# Altium schematic sheet Sheet1.SchDoc
size A4
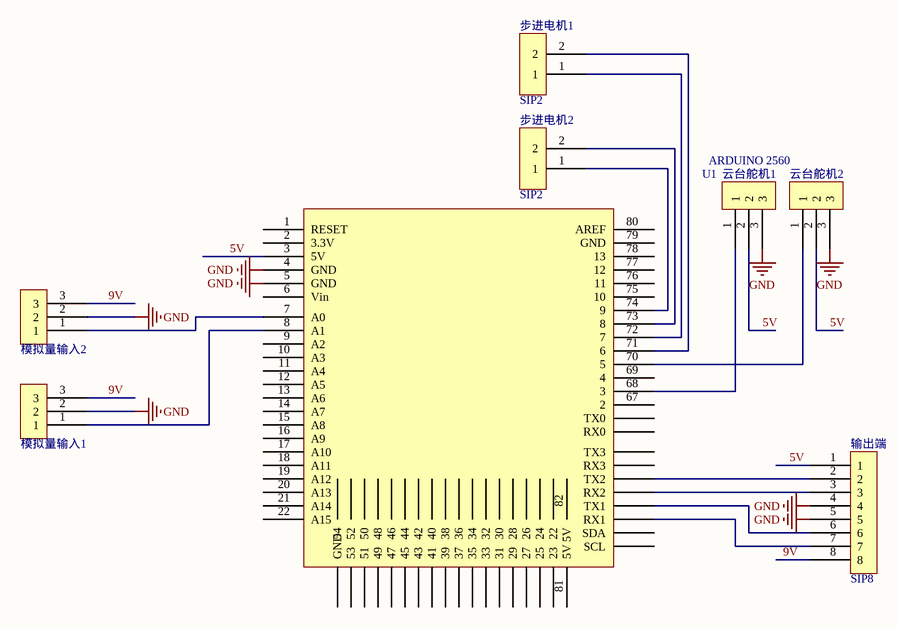
[diagram p0: Sheet1.SchDoc]

## Parts
U1  ARDUINO 2560  [ARDUINO 2560]
云台舵机1  SIP3  [SIP3-3MM]  (value not drawn)
云台舵机2  SIP3  [SIP3-3MM]  (value not drawn)
模拟量输入1  SIP3  [SIP3-3MM]  (value not drawn)
模拟量输入2  SIP3  [SIP3-3MM]  (value not drawn)
步进电机1  SIP2  [SIP2-3MM]
步进电机2  SIP2  [SIP2-3MM]
输出端  SIP8  [SIP8]

## Nets
GND: U1.4(GND) U1.5(GND) 云台舵机1.3 云台舵机2.3 模拟量输入1.2 模拟量输入2.2 输出端.4 输出端.5
5V: U1.3(5V) 云台舵机1.2 云台舵机2.2 输出端.1
9V: 模拟量输入1.3 模拟量输入2.3 输出端.8
NetU1_7: U1.7(A0) 模拟量输入2.1
NetU1_8: U1.8(A1) 模拟量输入1.1
NetU1_59: U1.59(RX1) 输出端.7
NetU1_60: U1.60(TX1) 输出端.6
NetU1_61: U1.61(RX2) 输出端.3
NetU1_62: U1.62(TX2) 输出端.2
NetU1_68: U1.68(3) 云台舵机1.1
NetU1_70: U1.70(5) 云台舵机2.1
NetU1_71: U1.71(6) 步进电机1.2
NetU1_72: U1.72(7) 步进电机1.1
NetU1_73: U1.73(8) 步进电机2.2
NetU1_74: U1.74(9) 步进电机2.1

Not connected (* = marked no-connect by the designer): U1 1(RESET) 2(3.3V) 6(Vin) 9(A2) 10(A3) 11(A4) 12(A5) 13(A6) 14(A7) 15(A8) 16(A9) 17(A10) 18(A11) 19(A12) 20(A13) 21(A14) 22(A15) 23(22) 24(23) 25(24) 26(25) 27(26) 28(27) 29(28) 30(29) 31(30) 32(31) 33(32) 34(33) 35(34) 36(35) 37(36) 38(37) 39(38) 40(39) 41(40) 42(41) 43(42) 44(43) 45(44) 46(45) 47(46) 48(47) 49(48) 50(49) 51(50) 52(51) 53(52) 54(53) 55(54) 56(GND) 57(SCL) 58(SDA) 63(RX3) 64(TX3) 65(RX0) 66(TX0) 67(2) 69(4) 75(10) 76(11) 77(12) 78(13) 79(GND) 80(AREF) 81(5V) 82(5V)